# EasyEDA Pro project OpenEarable-PCB-main-2.0.epro, board OpenEarable v2.7 Main - Layout
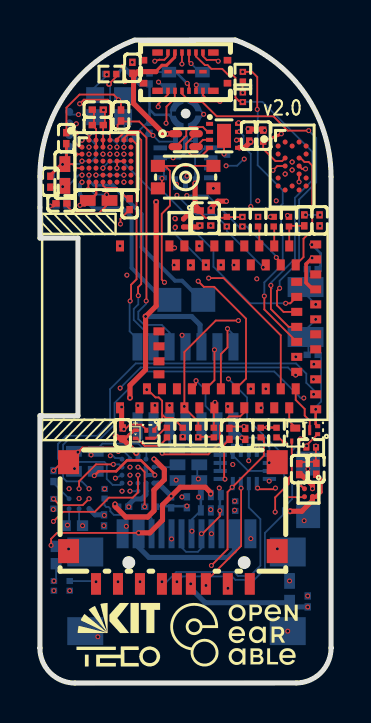
[diagram p1: board, top side]
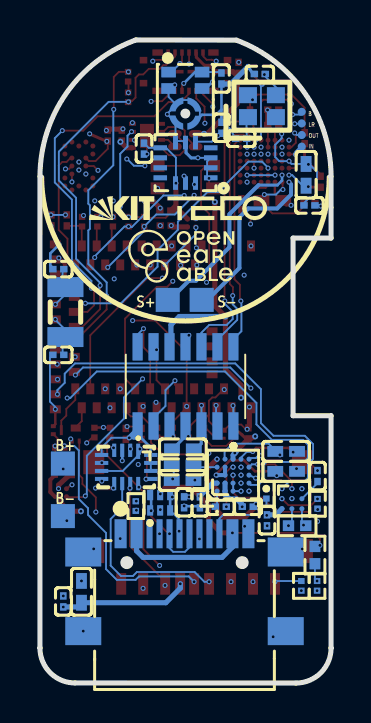
[diagram p2: board, bottom side, seen from below]

Outline 14.58 x 32.18 mm; copper layers: Top Layer, GROUND PLANE, Inner1, Inner2, POWER PLANE, Bottom Layer. Coordinates in mm from the lower left corner of the outline.
Outline path: 0,25.34 0,22.27 1.9,22.27 1.9,13.38 0,13.38 0,1.75 arc(0.51,0.51) 1.75,0 12.83,0 arc(14.07,0.52) 14.58,1.75 14.58,1.76 14.58,25.34 arc(13.25,29.52) 9.78,32.18 4.74,32.17 arc(1.3,29.5) 0,25.34
Stack: Top Layer 0.035mm 外层铜厚1oz / Dielectric1 0.0994mm 3313 RC57% 4.2mil / GROUND PLANE 0.0152mm 内层铜厚 / Dielectric2 0.55mm 0.55mm H/H不含铜 / Inner1 0.0152mm 内层铜厚 / Dielectric3 0.1088mm 2116 RC54% 4.9mil / Inner2 0.0152mm 内层铜厚 / Dielectric4 0.55mm 0.55mm H/H不含铜 / POWER PLANE 0.0152mm 内层铜厚 / Dielectric5 0.0994mm 3313 RC57% 4.2mil / Bottom Layer 0.035mm 外层铜厚1oz

## Design rules (mm)
template: Custom Config
spacing copperThickness1oz (default): track to track 0.09, other pairs 0.1 to 0.4
spacing copperThickness2oz: track to track 0.203, other pairs 0.152 to 0.3
spacing copperThicknessInner0.5oz: track to track 0.089, other pairs 0.152 to 0.3
track width copperThickness1oz (default): min 0.09, default 0.254, max 2.54
track width copperThickness2oz: min 0.203, default 0.254, max 2.54
track width copperThickness0.5oz: min 0.089, default 0.254, max 2.54
differential pair differentialPair (default): width min 0.127, default 0.254, max 2.54; gap min 0.152, default 0.152
via viaSize (default): diameter min 0.25, default 0.25, max 0.5; hole min 0.15, default 0.15, max 0.5

## Placement (name value [footprint] x y rotation side)
C1  1uF  [C0201]  8.28 22.89 180 top
C2  9pF  [C0201]  13.66 20.71 180 bottom
C3  4.7uF  [C0201]  13.24 23.15 90 top
C4  4.7uF  [C0201]  14 23.15 270 top
C5  1uF  [C0201]  10.48 27.39 270 top
C6  100nF  [C0201]  13.41 4.08 90 bottom
C7  1uF  [C0201]  8.3 23.64 0 top
C8  10uF  [C0402]  12.5 4.56 270 bottom
C9  1uF  [C0201]  7.36 9.05 270 bottom
C10  1uF  [C0201]  5.52 8.82 0 bottom
C11  100nF  [C0201]  9.37 26.74 90 bottom
C12  100nF  [C0201]  10.28 12.47 270 top
C13  100nF  [C0201]  5.49 27.79 90 bottom
C14  9pF  [C0201]  13.66 16.42 180 bottom
C16  4.7uF, 10V  [C0402]  2.25 10.59 0 bottom
C17  1uF &gt;10V  [C0201]  4.14 12.49 90 top
C18  10uF, &gt;4V  [C0402]  7.44 10.14 180 bottom
C19  1uF &gt;10V  [C0201]  4.17 8.82 180 bottom
C20  4.7uF, 10V  [C0402]  2.25 11.59 0 bottom
C21  1uF  [C0201]  3.21 8.14 90 bottom
C22  1uF &gt;10V  [C0201]  6.57 9.04 270 bottom
C23  2.2uF  [C0201]  0.68 10.36 270 bottom
C26  100nF  [C0201]  9.49 12.47 90 top
C27  100nF  [C0201]  11.18 27.39 270 top
C28  1uF  [C0201]  12.98 10.7 90 top
C29  1uF  [C0201]  13.84 10.72 270 top
C31  100nF  [C0201]  2.9 28.69 0 top
C32  1uF  [C0201]  4.49 23.96 270 top
C33  10uF  [C0402]  2.94 24.15 0 top
C34  10uF  [C0402]  1.25 25.43 270 bottom
C36  1uF  [C0201]  2.9 27.92 0 top
C38  100nF  [C0201]  5.49 30.25 90 bottom
C40  100nF  [C0201]  4.06 28.4 90 top
C41  10uF  [C0402]  1.25 25.42 270 top
C42  100nF  [C0201]  1.08 24 0 top
C43  100nF  [C0201]  1.32 27.27 90 top
C44  100nF  [C0201]  1.08 23.9 180 bottom
C45  33pF  [C0201]  3.56 30.48 0 bottom
C46  33pF  [C0201]  4.5 27.24 180 bottom
C47  1uF  [C0201]  0.52 25.09 270 top
C48  100nF  [C0201]  4.63 30.79 90 top
C49  10nF  [C0402]  7.42 11.72 180 bottom
CARD1  TF-06A  [TF-SMD_TF-06A]  6.66 8.01 180 top
CN1  BM46B-12DS-0.35V(53)  [FPC-SMD_12P-P0.35_BM46B-12DS-0.35V]  7.29 30.59 0 top
CRYSTAL1  24.576MHz  [CRYSTAL-SMD_4P-L2.0-W1.6-BL_HUAXIN_CN4]  3.46 28.87 180 bottom
D2  PRTR5V0U2F  [SON-6_L1.5-W1.0-P0.50-BL]  8.56 9.02 180 bottom
J1  CLE-107-01-G-DV  [CLE-107-01-X-DV]  7.29 14.84 180 bottom
L2  2.2uH  [L0402]  7.44 10.92 0 bottom
LED3  MHPA1010RGBDT  [LED-ARRAY-SMD_4P-L1.0-W1.0-TR-RD]  7.3 27.16 90 top
MDBT531  -  [MDBT53]  7.26 17.82 90 top
NOREF  -  [Pad_e353]  13.43 8.35 0 top
NOREF#2  -  [Pad_e359]  1.47 27.42 0 top
NOREF#3  -  [Pad_e357]  1.47 28.01 0 top
NOREF#4  -  [Pad_e355]  6.48 19.17 0 top
NOREF#5  -  [Pad_e358]  1.47 26.84 0 top
NOREF#6  -  [Pad_e354]  8.18 19.17 0 top
NOREF#7  -  [Pad_e352]  13.43 10.98 0 top
NOREF#8  -  [Pad_e356]  1.47 28.59 0 top
Q1  CSD23382F4  [PICOSTAR-3_L1.0-W0.6-P0.35-TL]  12.79 12.43 90 top
Q2  CSD13380F3T  [PICOSTAR-3_L0.7-W0.6-P0.40-TL]  5.53 12.45 270 top
Q3  CSD13380F3T  [PICOSTAR-3_L0.7-W0.6-P0.40-TL]  13.71 12.65 180 top
R1  10kΩ  [R0201]  13.59 11.79 0 top
R2  10kΩ  [R0201]  8.71 12.53 90 top
R3  10kΩ  [R0201]  7.93 12.53 90 top
R4  510Ω  [R0201]  6.36 12.53 90 top
R5  2kΩ  [R0201]  9.36 23.09 270 top
R6  51kΩ  [R0201]  0.7 4.86 90 bottom
R7  5.1kΩ  [R0201]  9.78 8.86 270 bottom
R8  5.1kΩ  [R0201]  3.24 9.47 270 bottom
R9  2kΩ  [R0201]  10.14 23.09 270 top
R10  2kΩ  [R0201]  10.16 29.31 270 top
R11  2kΩ  [R0201]  10.16 30.34 90 top
R13  37.4kΩ, 1%  [R0402]  0.81 6.4 90 bottom
R15  10kΩ  [R0201]  11.85 12.53 90 top
R17  10kΩ  [R0201]  0.68 8.97 270 bottom
R19  10kΩ  [R0201]  1.49 4.86 270 bottom
R20  10kΩ  [R0201]  11.06 12.53 90 top
R21  10mΩ, 1%  [R0402]  1.7 7.87 0 bottom
R23  27Ω  [R0201]  11.71 23.09 270 top
R26  27Ω  [R0201]  10.92 23.09 270 top
R27  2.2Ω  [R0201]  12.47 23.09 270 top
R28  220Ω  [R0201]  3.58 30.48 0 top
SW1  TS2819A 230GF  [SW-SMD_4P-L2.8-W1.9-P1.16-LS3.0]  7.3 25.32 0 top
U1  BMX160  [LGA-14_L3.0-W2.5-P0.50-BL]  7.29 26.03 90 bottom
U2  BQ25120AYFPR  [DSBGA-25_L2.5-W2.6-R5-C5-P0.40-BL]  4.91 10.4 180 bottom
U3  AP22916BCA4-7  [x1-wlb0808-4_l0.8-w0.8-p0.40-tl]  6.99 23.02 270 top
U4  XL-0201SURC  [LED-SMD_L0.65-W0.35-P0.41_XL-0201SURC]  4.79 12.44 90 top
U5  KTD2026  [DFN-8_L1.5-W1.5-P0.40-BL-EP]  9.22 27.38 270 top
U6  BQ27220YZFR  [DSBGA-9_L1.7-W1.6-R3-C3-P0.50-BL]  1.96 9.22 270 bottom
U8  1MΩ  [R0201]  7.15 12.53 270 top
U9  AP22916BCA4-7  [x1-wlb0808-4_l0.8-w0.8-p0.40-tl]  13.45 9.52 270 top
U10  SN74AXC4T774RSVR  [UQFN-16_L2.6-W1.8-P0.40-BL]  10.26 10.81 0 bottom
U12  GT-USB-9047A  [USB-C-SMD_GT-USB-9047A]  7.34 5.03 180 bottom
U13  SPH0641LU4H-1  [MIC-SMD_5P_L3.5-W2.7-P0.82_SPH0641LU4H-1]  7.3 29.31 180 bottom
U14  MX25R6435FBFIL0  [WLCSP-22_MX25R6435FBFIL0]  12.63 25.87 0 top
U15  ADAU1860BCBZRL  [BGA-56_L3.0-W2.7-P0.35-R8-C7-TL]  3.33 26.12 0 top
X1  Q13FC1350000200  [FC-135R_L3.2-W1.5]  13.3 18.56 90 bottom

## Footprints (pads in the part's own frame, mm; a bottom-side part is the same pattern mirrored in y, then rotated)
BGA-56_L3.0-W2.7-P0.35-R8-C7-TL
  round 0.25 smd: A1(-1.225,1.05) A2(-0.875,1.05) A3(-0.525,1.05) A4(-0.175,1.05) A5(0.175,1.05) A6(0.525,1.05) A7(0.875,1.05) A8(1.225,1.05) B1(-1.225,0.7) B2(-0.875,0.7) B3(-0.525,0.7) B4(-0.175,0.7) B5(0.175,0.7) B6(0.525,0.7) B7(0.875,0.7) B8(1.225,0.7) C1(-1.225,0.35) C2(-0.875,0.35) C3(-0.525,0.35) C4(-0.175,0.35) C5(0.175,0.35) C6(0.525,0.35) C7(0.875,0.35) C8(1.225,0.35) D1(-1.225,0) D2(-0.875,0) D3(-0.525,0) D4(-0.175,0) D5(0.175,0) D6(0.525,0) D7(0.875,0) D8(1.225,0) E1(-1.225,-0.35) E2(-0.875,-0.35) E3(-0.525,-0.35) E4(-0.175,-0.35) E5(0.175,-0.35) E6(0.525,-0.35) E7(0.875,-0.35) E8(1.225,-0.35) F1(-1.225,-0.7) F2(-0.875,-0.7) F3(-0.525,-0.7) F4(-0.175,-0.7) F5(0.175,-0.7) F6(0.525,-0.7) F7(0.875,-0.7) F8(1.225,-0.7) G1(-1.225,-1.05) G2(-0.875,-1.05) G3(-0.525,-1.05) G4(-0.175,-1.05) G5(0.175,-1.05) G6(0.525,-1.05) G7(0.875,-1.05) G8(1.225,-1.05)
C0201
  rect 0.368x0.324 smd: 1(-0.275,0) 2(0.274,0)
C0402
  rect 0.79x0.54 smd: 1(-0.545,0) 2(0.545,0)
CLE-107-01-X-DV
  custom 0.508x1.37 smd: 1(2.4,-1.98) 2(2.4,1.98) 3(1.6,-1.98) 4(1.6,1.98) 5(0.8,-1.98) 6(0.8,1.98) 7(0,-1.98) 8(0,1.98) 9(-0.8,-1.98) 10(-0.8,1.98) 11(-1.6,-1.98) 12(-1.6,1.98) 13(-2.4,-1.98) 14(-2.4,1.98)
CRYSTAL-SMD_4P-L2.0-W1.6-BL_HUAXIN_CN4
  rect 0.9x0.8 smd: 1(-0.7,-0.55) 2(0.7,-0.55) 3(0.7,0.55) 4(-0.7,0.55)
DFN-8_L1.5-W1.5-P0.40-BL-EP
  rect 0.2x0.35 smd: 1(-0.6,-0.725) 2(-0.2,-0.725) 3(0.2,-0.725) 4(0.6,-0.725) 5(0.6,0.725) 6(0.2,0.725) 7(-0.2,0.725) 8(-0.6,0.725)
  rect 1.2x0.7 smd: 9(0,0)
DSBGA-9_L1.7-W1.6-R3-C3-P0.50-BL
  round 0.25 smd: A1(-0.5,-0.5) A2(-0.5,0) A3(-0.5,0.5) B1(0,-0.5) B2(0,0) B3(0,0.5) C1(0.5,-0.5) C2(0.5,0) C3(0.5,0.5)
DSBGA-25_L2.5-W2.6-R5-C5-P0.40-BL
  round 0.25 smd: A1(-0.8,-0.8) A2(-0.8,-0.4) A3(-0.8,0) A4(-0.8,0.4) A5(-0.8,0.8) B1(-0.4,-0.8) B2(-0.4,-0.4) B3(-0.4,0) B4(-0.4,0.4) B5(-0.4,0.8) C1(0.002,-0.8) C2(0,-0.4) C3(0,0) C4(0,0.4) C5(0,0.8) D1(0.4,-0.8) D2(0.4,-0.4) D3(0.4,0) D4(0.4,0.4) D5(0.4,0.8) E1(0.8,-0.8) E2(0.8,-0.4) E3(0.8,0) E4(0.8,0.4) E5(0.8,0.8)
FC-135R_L3.2-W1.5
  rect 1x1.8 smd: 1(-1.25,0) 2(1.25,0)
FPC-SMD_12P-P0.35_BM46B-12DS-0.35V
  rect 0.18x0.315 smd: 1(-0.875,0.958) 2(-0.875,-0.958) 3(-0.525,0.958) 4(-0.525,-0.958) 5(-0.175,0.958) 6(-0.175,-0.958) 7(0.175,0.958) 8(0.175,-0.958) 9(0.525,0.958) 10(0.525,-0.958) 11(0.875,0.958) 12(0.875,-0.958)
  rect 0.525x0.315 smd: 13(1.397,0.958) 14(1.398,-0.958) 15(-1.397,0.958) 16(-1.398,-0.958)
  rect 0.38x0.33 smd: 17(2.105,0.575) 18(2.105,-0.575) 19(-2.105,0.575) 20(-2.105,-0.575)
  rect 0.37x0.18 smd: 21(-0.875,0) 22(-0.285,0) 23(0.285,0) 24(0.875,0)
L0402
  rect 0.79x0.54 smd: 1(-0.545,0) 2(0.545,0)
LED-ARRAY-SMD_4P-L1.0-W1.0-TR-RD
  oval 0.364x0.687 smd: 1(0.325,0.518) 2(0.325,-0.519) 3(-0.325,-0.519) 4(-0.325,0.518)
LED-SMD_L0.65-W0.35-P0.41_XL-0201SURC
  rect 0.17x0.28 smd: 1(0.205,0) 2(-0.205,0)
LGA-14_L3.0-W2.5-P0.50-BL
  rect 0.25x0.675 smd: 1(-0.75,-1.262) 2(-0.25,-1.262) 3(0.25,-1.262) 4(0.75,-1.262) 8(0.75,1.262) 9(0.25,1.262) 10(-0.25,1.262) 11(-0.75,1.262)
  rect 0.675x0.25 smd: 5(1.013,-0.5) 6(1.013,0) 7(1.013,0.5) 12(-1.013,0.5) 13(-1.013,0) 14(-1.013,-0.5)
MDBT53
  rect 0.55x0.4 smd: 1(-4.05,3.25) 2(-4.05,2.275) 3(-3.1,1.9) 4(-4.05,1.525) 5(-3.1,1.15) 6(-4.05,0.775) 7(-3.1,0.4) 8(-4.05,0.025) 9(-3.1,-0.35) 10(-4.05,-0.725) 11(-3.1,-1.05) 12(-4.05,-1.475) 13(-3.1,-1.8) 14(-4.05,-2.225) 15(-3.1,-2.55) 16(-4.05,-2.975) 17(-3.1,-3.3) 18(-4.05,-3.725) 19(-3.1,-4.05) 20(-4.05,-4.475) 21(-3.1,-4.8) 22(-4.05,-5.225) 23(-3.1,-5.55) 43(3.1,-5.55) 44(4.05,-5.225) 45(3.1,-4.8) 46(4.05,-4.475) 47(3.1,-4.05) 48(4.05,-3.725) 49(3.1,-3.3) 50(4.05,-2.975) 51(3.1,-2.55) 52(4.05,-2.225) 53(3.1,-1.8) 54(4.05,-1.475) 55(3.1,-1.05) 56(4.05,-0.725) 57(3.1,-0.3) 58(4.05,0.025) 59(3.1,0.45) 60(4.05,0.775) 61(4.05,3.25)
  rect 0.4x0.55 smd: 24(-4.125,-6.55) 25(-3.375,-6.55) 26(-2.625,-6.55) 27(-2.25,-5.6) 28(-1.875,-6.55) 29(-1.5,-5.6) 30(-1.125,-6.55) 31(-0.75,-5.6) 32(-0.375,-6.55) 33(0,-5.6) 34(0.375,-6.55) 35(0.75,-5.6) 36(1.125,-6.55) 37(1.5,-5.6) 38(1.875,-6.55) 39(2.25,-5.6) 40(2.625,-6.55) 41(3.375,-6.55) 42(4.125,-6.55) 62(-2.375,1.3) 63(-1.725,1.3) 64(-0.975,1.3) 65(-0.225,1.3)
MIC-SMD_5P_L3.5-W2.7-P0.82_SPH0641LU4H-1
  rect 0.73x0.53 smd: 1(-0.838,1.26) 2(-0.838,0.438) 4(0.838,0.438) 5(0.838,1.26)
  custom 0.696x0.705 smd: 3(0.459,-0.379) 7(-0.459,-1.25)
  custom 0.704x0.696 smd: 6(0.453,-1.26) 8(-0.453,-0.369)
Pad_e352
  rect 1.2x1.2 smd far side: 14(0,0)
Pad_e353
  rect 1.2x1.2 smd far side: 14(0,0)
Pad_e354
  rect 1.2x1.2 smd far side: 11(0,0)
Pad_e355
  rect 1.2x1.2 smd far side: 11(0,0)
Pad_e356
  round 0.4 smd far side: 11(0,0)
Pad_e357
  round 0.4 smd far side: 11(0,0)
Pad_e358
  round 0.4 smd far side: 11(0,0)
Pad_e359
  round 0.4 smd far side: 11(0,0)
PICOSTAR-3_L0.7-W0.6-P0.40-TL
  rect 0.25x0.2 smd: 1(-0.2,0.2) 2(-0.2,-0.2)
  rect 0.15x0.5 smd: 3(0.2,0)
PICOSTAR-3_L1.0-W0.6-P0.35-TL
  rect 0.25x0.15 smd: 1(-0.325,0.175) 2(-0.325,-0.175)
  rect 0.35x0.5 smd: 3(0.325,0)
R0201
  rect 0.303x0.324 smd: 1(-0.241,0) 2(0.241,0)
R0402
  rect 0.566x0.54 smd: 1(-0.433,0) 2(0.432,0)
SON-6_L1.5-W1.0-P0.50-BL
  rect 0.3x0.52 smd: 1(-0.5,-0.385) 2(0,-0.385) 3(0.5,-0.385) 4(0.5,0.385) 5(0,0.385) 6(-0.5,0.385)
SW-SMD_4P-L2.8-W1.9-P1.16-LS3.0
  rect 0.7x0.6 smd: 1(-1.39,0.563) 2(1.39,0.563) 3(-1.39,-0.563) 4(1.39,-0.563)
TF-SMD_TF-06A
  rect 0.5x1.08 smd: 1(-3.85,3.045) 2(-2.75,3.045) 3(-1.65,3.045) 4(-0.9,3.045) 5(0.55,3.045) 6(1.65,3.045) 7(2.75,3.045) 8(3.85,3.045) G(-0.2,3.045)
  rect 1.05x1.2 smd: 10(5.225,1.405) 11(5.225,-3.045) 12(-5.225,-3.045) 13(-5.225,1.405)
UQFN-16_L2.6-W1.8-P0.40-BL
  rect 0.2x0.765 smd: 1(-0.6,-0.782)
  rect 0.2x0.665 smd: 2(-0.2,-0.833) 3(0.2,-0.833) 4(0.6,-0.833) 9(0.6,0.833) 10(0.2,0.833) 11(-0.2,0.833) 12(-0.6,0.833)
  rect 0.665x0.2 smd: 5(1.232,-0.6) 6(1.232,-0.2) 7(1.232,0.2) 8(1.232,0.6) 13(-1.232,0.6) 14(-1.232,0.2) 15(-1.232,-0.2) 16(-1.232,-0.6)
USB-C-SMD_GT-USB-9047A
  rect 1.8x1.45 smd: 12(-5.07,1.524) 13(5.07,1.524)
  rect 1.8x1.4 smd: 14(-5.07,-2.437) 15(5.07,-2.437)
  rect 0.6x1.45 smd: A1B12(-3.2,2.437) A4B9(-2.4,2.437) A9B4(2.4,2.437) A12B1(3.2,2.437)
  rect 0.3x1.45 smd: A5(-1.25,2.437) A6(-0.25,2.437) A7(0.25,2.437) A8(1.25,2.437) B5(1.75,2.437) B6(0.75,2.437) B7(-0.75,2.437) B8(-1.75,2.437)
WLCSP-22_MX25R6435FBFIL0
  round 0.25 smd: A2(-0.35,1.2) A4(0.35,1.2) B1(-0.7,1) B3(0,1) B5(0.7,1) C1(-0.7,0.6) C5(0.7,0.6) D2(-0.35,0.4) D4(0.35,0.4) E3(0,0.2) F2(-0.35,0) F4(0.35,0) G3(0,-0.2) H2(-0.35,-0.4) H4(0.35,-0.4) J1(-0.7,-0.6) J5(0.7,-0.6) K1(-0.7,-1) K3(0,-1) K5(0.7,-1) L2(-0.35,-1.2) L4(0.35,-1.2)
x1-wlb0808-4_l0.8-w0.8-p0.40-tl
  round 0.25 smd: A1(-0.2,0.2) A2(0.2,0.2) B1(-0.2,-0.201) B2(0.2,-0.201)

## Nets
As in the schematic, except:
GND: C1.1 C2.1 C3.2 C4.1 C5.1 C6.2 C7.2 C8.1 C9.2 C10.2 C11.1 C12.1 C13.2 C14.1 C16.1 C17.2 C18.2 C19.2 C20.1 C21.1 C22.2 C23.1 C26.2 C27.1 C28.2 C29.1 C31.2 C32.2 C33.1 C34.2 C36.2 C38.1 C40.2 C41.2 C42.1 C43.2 C44.2 C45.2 C46.1 C47.2 C48.2 C49.1 CARD1.6 CARD1.10 CARD1.11 CARD1.12 CARD1.13 CN1.10 CRYSTAL1.2 CRYSTAL1.4 D2.2 J1.7 MDBT531.1 MDBT531.24 MDBT531.42 MDBT531.61 NOREF.14 Q2.2 Q3.2 R1.2 R6.1 R7.1 R8.1 R17.2 R19.2 SW1.3 SW1.4 U1.1 U1.2 U1.3 U1.6 U1.7 U2.A1 U2.A5 U2.C1 U2.C2 U2.D1 U2.D5 U3.B1 U5.8 U5.9 U6.B2 U8.2 U9.B1 U10.6 U10.8 U12.12 U12.13 U12.14 U12.15 U12.A1B12 U12.A12B1 U13.2 U13.3 U13.6 U13.7 U13.8 U14.E3 U15.A1 U15.A4 U15.B4 U15.D6 U15.D7 U15.E6 U15.F1 U15.G3 U15.G7
BCLK: MDBT531.59 NOREF#8.11 U15.B2
DAC_N: NOREF#4.11 U15.G1
DAC_P: NOREF#6.11 U15.F2
DIN: MDBT531.60 NOREF#5.11 U15.C1
DOUT: MDBT531.56 NOREF#2.11 U15.B1
LRCLK: MDBT531.57 NOREF#3.11 U15.C2
V_BAT: C21.2 NOREF#7.14 R21.1 U6.C1 U6.C3

Pads without a net: CARD1 1; CN1 13 14 15 16 17 18 19 20 21 22 23 24; MDBT531 5 7 10 20 28 30 32 39 40 49 50 52 54 58 62 63 64 65; U1 4 9 10 11; U5 1; U12 A8 B8; U14 A2 A4 B1 B3 B5 C1 C5 J1 J5 K1 K3 K5 L2 L4; U15 B8 C3 C8 D2 D3 D4 D5 D8 E2 E3 E5 E7 E8 F4 F5 F6 F8 G5 G6 G8

## Via types
v1: diameter 0.25, hole 0.15, Top Layer to Bottom Layer, 250 vias
v2: diameter 0.3, hole 0.15, Top Layer to Bottom Layer, 10 vias

## Routing (per net, layer and track width the routed paths; a pad name or vN(x,y) marks a point on that pad's centre or on a via; arc(x,y) is an arc through that point)
3V3: length 50.4
  Top Layer w0.15: 5.78,30.58 6.11,30.91 6.34,30.91 6.75,31.32 6.75,31.53 ; 4.9,12.65 4.73,12.65 4.46,12.42 4.23,12.19
  Top Layer w0.2: 13.65,9.32 13.83,9.32 14.06,9.56 14.06,10.18 13.84,10.4 C29.2
  Top Layer w0.25: 4.83,11.51 4.18,12.19
  Top Layer w0.254: 5.82,30.59 4.91,30.59 4.69,30.37 4.69,29 6.2,27.49 6.43,27.49 ; 9.98,26.78 9.98,26.79 10.22,26.79 ; 6.36,27.49 6.78,27.49 LED3.1 ; v2(10.55,27.09) 10.54,27.09 10.24,26.78 ; 5.82,24.07 5.82,18.87 5.3,18.34 ; v2(5.29,18.34) 5.29,15.68 4.51,14.9 4.51,14.28 ; 3.8,12.34 4.18,12.15 ; 4.18,12.15 4.22,12.19 4.23,12.19 4.18,12.15 ; v2(12.53,8.6) 13.11,8.6 13.65,9.13 13.65,9.32
  Inner1 w0.254: 4.51,14.28 4.51,13.6 3.8,12.89 3.8,12.34 ; v2(10.55,27.09) 10.83,27.37 10.83,28.01 10.38,28.47 9.57,28.47 8.59,27.49 6.36,27.49
  Inner2 w0.254: 4.82,11.51 5.31,11.02 5.31,9.39 6.49,8.21 10.77,8.21 11.52,8.96 12.31,8.96 12.53,8.74 12.53,8.59 ; v2(6.36,27.48) 6.36,27.21 5.6,26.46 5.6,24.29 v2(5.82,24.07)
  Bottom Layer w0.24: 4.74,11.58 4.91,11.4 4.91,11.2
  Bottom Layer w0.254: 5.29,18.34 7.6,18.34 8.02,17.92 8.02,16.93 8.09,16.86
  vias: v2(3.8,12.34) v2(4.51,14.28) v2(4.82,11.51)
+1.8V: length 11.3
  Top Layer w0.09: v1(7.92,12.32) 8.68,12.32 R2.1
  Top Layer w0.18: v1(13.63,21.27) 13.33,20.97 13.33,20.03 13.67,19.7 MDBT531.38
  Top Layer w0.254: v1(8.01,22.89) 7.94,22.82 U3.A2
  Inner1 w0.09: v1(9.66,10.94) 8.66,10.94 v1(7.93,10.21)
  Inner1 w0.254: 14.03,22.88 14.02,22.87 14.02,21.66 v1(13.63,21.27)
  Bottom Layer w0.09: 2.81,11.66 3.13,11.98 4.93,11.98 5.33,11.58 5.33,11.28 ; 7.89,10.3 7.88,10.31 7.88,10.97 7.86,11
  vias: v1(2.56,11.42) v1(13.04,12.22) v1(14.03,22.88)
GND: length 58.8
  Top Layer w0.09: 1.33,27.47 1.33,28.79 1.98,29.45 3.69,29.45 3.91,29.23 ; 6.11,25.25 6.11,24.92 5.99,24.8 ; 7.84,29.93 7.84,29.68 7.82,29.66 ; v1(3.93,29.19) 4.06,29.06 C40.2 ; C32.2 4.03,23.23 v1(4.03,22.97) ; v1(9.22,26.47) U5.9 ; 13.08,10.98 13.16,11.06 13.76,11.07 C29.1 13.82,11.02 v1(13.82,11.86) ; 3.17,26.81 3.17,27.83 3.25,27.92 3.25,28.57 3.27,28.58 ; 4.18,12.7 4.26,12.7 4.5,12.93 5.07,12.93 5.31,12.69 ; 3.87,25.76 3.87,26.11 4.22,26.11 ; v1(10.22,12.84) 9.58,12.84 C26.2 ; 1.43,11.11 1.15,11.11 v1(0.68,10.63)
  Top Layer w0.1: 12.94,9.87 13.08,9.87 13.23,9.73
  Top Layer w0.12: v1(2,23.91) 2.25,23.91 2.81,24.47 2.81,25.06
  Top Layer w0.127: 1.92,11.55 2.13,11.77 3.75,11.77 3.93,11.57 ; v1(13.81,13.7) 13.81,12.95 Q3.2
  Top Layer w0.15: 0.52,23.88 0.68,23.88 0.79,23.99 ; 0.53,24.81 1.13,24.81 1.15,24.83
  Top Layer w0.254: v1(4.09,13.81) 4.09,12.85 4.18,12.77 ; 8.55,23.76 8.9,24.11 9.33,24.11 ; 10.44,27.72 11.15,27.72 11.2,27.67
  Top Layer w0.257: 5.72,11.2 6.23,10.69 6.23,10.18 5.71,9.66 5.71,8.62 5.4,8.31 4.3,8.31 3.76,8.85 3.76,8.96
  Inner2 w0.09: 10.91,24.13 10.81,24.23 9.44,24.21 v1(9.34,24.11)
  Inner2 w0.127: 1.14,24.84 0.51,24.21 v1(0.51,23.87)
  Bottom Layer w0.09: 3.93,11.57 4.22,11.57 4.52,11.27 ; 4.52,9.6 4.9,9.6 4.9,10 4.9,10 ; 4.76,27.16 5.03,27.7 5.47,28.14 ; v1(6.67,26.28) U1.3 6.21,26.1 6.21,25.3 ; v1(13.3,23.43) v1(14.03,23.43) ; U13.2 8.14,29.33 U13.8 7.52,29.18 7.02,29.18 6.84,29 6.84,28.93 6.57,28.67 6.57,28.33 6.85,28.05 ; C10.2 5.71,8.91 U2.A1 ; v1(13.81,13.7) 13.81,13.81 14.08,14.08 14.08,16.28 C14.1 ; 7.75,28.94 8.2,28.49 v1(8.2,28.46) 7.79,28.05 7.79,27.05 7.71,27.12 7.29,27.12 ; v1(1.14,24.84) 1.37,24.84 1.94,25.41 2.12,25.41
  Bottom Layer w0.127: 5.49,28.69 5.49,28.11 5.49,28.11 ; v1(13.62,21.94) 14.06,21.5 14.06,20.9 13.93,20.77 C2.1 ; 5.49,29.98 5.49,28.7 5.75,28.44 6.46,28.44 6.85,28.05 ; 7.36,8.85 5.82,8.85 C10.2
  Bottom Layer w0.15: 0.53,23.88 0.86,23.88 0.86,23.88 ; 3.88,30.45 3.9,30.45 4.15,30.85 ; 6.68,26.28 7.01,26.28 7.26,26.54 7.26,26.97 7.29,26.99 ; 7.22,12.42 7.74,11.9
  Bottom Layer w0.254: C38.1 5.03,29.98 v1(4.15,30.86)
  vias: v1(0.67,8.68) v1(0.7,4.62) v1(1.44,6.71) v1(1.49,4.62) v1(1.73,10.73) v1(1.9,11.55) v1(1.96,9.23) v1(2.11,27.17) v1(2.1,25.42) v1(2.9,2.31) v1(3.18,28.68) v1(3.2,7.87) v1(3.24,9.72) v1(3.76,8.96) v1(3.86,25.77) v1(3.92,11.59) v1(4.01,21.87) v1(4.21,25.07) v1(4.2,12.7) v1(4.33,7.84) v1(4.51,9.6) v1(4.62,31.06) v1(5.01,5.07) v1(5.71,11.2) v1(6.11,25.25) v1(6.76,23.25) v1(6.82,10.16) v1(7.15,12.34) v1(7.36,8.86) v1(7.83,29.93) v1(8.56,23.77) v1(8.55,22.89) v1(8.55,8.68) v1(8.69,24.75) v1(9.75,9.1) v1(9.95,28.04) v1(10.42,27.73) v1(10.56,7.23) v1(10.91,24.13) v1(11.25,27.65) v1(11.48,11.03) v1(11.48,10.11) v1(11.89,6.71) v1(12.41,2.6) v1(12.5,5.11) v1(12.63,26.07) v1(12.97,9.92) v1(13.23,8.12) v1(13.41,4.36)
VCC: length 5.9
  Inner1 w0.254: 2.13,7.87 2.55,7.46 3.35,7.46 4.45,8.55 v1(4.45,8.82)
  Bottom Layer w0.09: U6.C2 1.96,8.05 v1(2.13,7.87)
  Bottom Layer w0.25: 4.45,8.82 4.45,8.94 4.73,9.21 5.09,9.21 5.31,9.43 5.31,9.61 ; U2.B2 U2.B1
(no net):
  vias: v1(13.72,15.95)
#ERROR: length 4
  Top Layer w0.09: 6.12,13.52 6.12,13.1 5.71,12.69 ; 5.36,14.72 5.79,14.29 5.95,14.29 6.12,14.13 6.12,13.44 6.28,13.27 6.65,13.27 7.15,12.78 ; v1(5.35,14.68) 5.36,14.69 MDBT531.3
BCLK: length 10.7
  Inner2 w0.09: 6.65,20.86 6.65,20.94 4.76,22.83 4.76,23.59 3.49,24.86 3.49,25.89 3.28,26.1 2.91,26.1 2.79,26.22 2.79,26.61 2.58,26.81 2.46,26.81 2.56,26.81 2.81,27.06 2.81,27.64 2,28.45 v1(1.93,28.45)
  Bottom Layer w0.09: v1(1.93,28.45) 1.56,28.45 1.48,28.52
  vias: v1(2.46,26.82) v1(6.72,20.92)
CC_#CD: length 20.5
  Inner1 w0.09: v1(13.21,14.26) 13.35,14.39 13.35,14.84 v1(13.7,15.2)
  Bottom Layer w0.09: U2.E2 4.02,9.91 3.64,9.91 3.35,10.21 3.35,10.94 3.23,11.06 1.36,11.06 1.16,11.26 1.16,11.92 1.41,12.17 2.97,12.17 3.74,12.94 3.74,14.02 5.31,15.59 11.73,15.59 13.06,14.26 13.21,14.26
CC_#PG: length 7.8
  Top Layer w0.09: MDBT531.16 10.24,13.55 10.03,13.34 9.48,13.34 9.02,12.88 9.02,12.03 8.43,11.45 6.18,11.45 6.09,11.53
  Inner1 w0.09: 4.51,10.8 4.51,10.9 4.75,11.15 5.15,11.15 5.53,11.53 6.12,11.53 6.15,11.51
  vias: v1(4.51,10.8) v1(6.12,11.5)
DAC_ENABLE: length 13.6
  Top Layer w0.09: MDBT531.37 12.54,19 v1(12.31,19)
  Bottom Layer w0.09: v1(12.31,19) 10.52,19 8.69,20.83 8.69,21.66 7.67,22.68 7.67,23.09 6.19,24.57 5.66,24.57 4.14,26.09 3.46,26.09 3.16,25.8 3.16,25.76
  vias: v1(3.16,25.77)
DAC_N: length 8.7
  Bottom Layer w0.127: 2.1,25.06 2,24.96
  Bottom Layer w0.2: 2,24.96 2.01,24.44 2.7,23.75 4.15,23.75 4.59,23.31 4.59,20.77 6.33,19.03
  vias: v1(2.11,25.07)
DAC_P: length 9.1
  Bottom Layer w0.127: 2.69,24.92 2.46,25.15 v1(2.46,25.42)
  Bottom Layer w0.15: 2.69,24.92 3.63,24.92
  Bottom Layer w0.2: 3.63,24.92 5.09,23.46 5.09,21.81 6.77,20.13 7.12,20.13 7.88,19.37
DIN: length 8.7
  Top Layer w0.09: v1(1.78,26.46) 2.12,26.46
  Inner1 w0.09: v1(1.78,26.46) 1.78,24.85 2.52,24.12 4.33,24.12 6.67,21.78 6.74,21.78
  Bottom Layer w0.09: v1(1.78,26.46) 1.78,26.6 1.48,26.9
  vias: v1(6.74,21.78)
DOUT: length 12.5
  Top Layer w0.09: v1(1.82,27.53) 1.77,27.47 1.77,27.04 1.99,26.81 2.12,26.81
  Inner1 w0.09: 7.99,21.87 7.54,21.43 6.34,21.43 6.12,21.65 6.12,22.06 4.25,23.92 2.44,23.92 1.46,24.91 1.46,27.16 v1(1.82,27.53)
  Bottom Layer w0.09: 1.48,27.42 1.71,27.42 1.82,27.54
  vias: v1(7.98,21.87)
FLASH_RESET: length 6.5
  Top Layer w0.09: U14.F2 11.89,25.87 v1(11.67,25.66)
  Inner1 w0.09: v1(9.72,20.92) 9.72,23.58 10.75,24.6 11.19,24.6 11.54,24.95 11.54,25.52 v1(11.67,25.66)
GPOUT: length 19.8
  Bottom Layer w0.09: 2.46,9.72 2.09,10.09 1.33,10.09 1.16,10.26 1.16,10.96 0.9,11.23 0.9,11.96 1.31,12.37 2.88,12.37 3.51,13 3.51,14.71 4.8,15.99 12.83,15.99 13.34,15.48 13.34,15.02 13.71,14.66 v1(13.71,14.45)
  vias: v1(2.46,9.72)
INT: length 7.3
  Inner1 w0.09: v1(4.51,10) 6.16,10 6.64,10.48 7.47,10.48 9.41,12.43 v1(9.41,13.84)
IO1: length 3.3
  Top Layer w0.09: MDBT531.9 7.82,14.93 v1(7.82,15.13)
  Bottom Layer w0.09: 8.89,12.78 8.89,13.26 8.29,13.86 8.29,14.66 v1(7.82,15.13)
IO2: length 2.1
  Top Layer w0.09: MDBT531.11 8.74,15.15 v1(8.74,16.68)
IO3: length 4.3
  Top Layer w0.09: MDBT531.13 9.06,16.46 9.39,16.8 v1(9.39,17.73)
  Bottom Layer w0.09: 9.69,16.74 9.69,17.44 v1(9.39,17.73)
IO4: length 18.1
  Top Layer w0.09: MDBT531.35 12.2,18.57 11.87,18.9 11.87,19.62 12.01,19.76 ; CN1.6 7.11,29.49 7.53,29.08 8.13,29.08 8.85,28.36 11.69,28.36 12.41,27.64 v1(13.46,27.64)
  Bottom Layer w0.09: v1(13.46,27.64) 13.84,27.27 13.84,25.05 12.98,24.19 12.98,21.1 12,20.13 v1(12,19.76)
IO5: length 18.4
  Top Layer w0.09: 6.34,28.01 6.34,28.85 6.75,29.26 6.75,29.65 6.76,29.66 ; 12.06,14.72 12.06,17.4 9.2,20.26 8.45,20.26
  Inner2 w0.09: 8.45,20.26 7.88,20.83 7.88,21.51 7.22,22.17 7.22,23.26 6.49,23.99 6.49,25.57 7.01,26.09 7.01,27.32 v1(6.32,28.02)
  vias: v1(8.45,20.26)
IO6: length 18.1
  Top Layer w0.09: v1(5.92,28.84) 5.92,28.97 6.41,29.46 CN1.2 ; 9.81,14.72 10.32,15.23 10.32,18.23 8.73,19.83 8.21,19.83 7.93,20.11
  Inner2 w0.09: v1(7.93,20.11) 7.73,20.11 7.2,20.63 7.2,21.79 5.29,23.7 5.29,28.21 v1(5.92,28.84)
LRCLK: length 14
  Inner1 w0.09: 7.54,20.9 7.59,20.9 8.32,21.63 8.32,22.06 8,22.38 6.34,22.38 3.51,25.22 3.51,25.89 3.3,26.09 2.83,26.09 2.46,26.46
  Inner2 w0.09: 2.46,26.46 2.47,25.99 2.27,25.79 1.85,25.79 1.16,26.49 1.16,27.63 1.51,27.99 1.82,27.99
  Bottom Layer w0.09: 1.82,27.99 1.49,27.99 1.48,27.98
  vias: v1(1.82,27.99) v1(2.46,26.47) v1(7.54,20.9)
LSCTRL: length 14.9
  Inner1 w0.09: v1(3.78,10.25) 3.7,10.25 3.19,10.77 3.19,11.49 3.45,11.75 3.45,12.95 3.76,13.26 3.76,14.51 v1(4.02,14.76)
  Bottom Layer w0.09: 3.79,10.26 3.79,10.26 U2.E3 4.1,10.4 ; v1(4.02,14.76) 5.05,15.79 12.43,15.79 v1(12.8,15.41)
MR#: length 34.7
  Top Layer w0.09: 6.26,25.88 5.91,25.88 6.26,25.88 ; 6.26,25.88 6.51,25.63 6.51,23.89 6.1,23.48 6.1,20.19 6.24,20.05 ; 6.26,25.88 8.69,25.88 ; v1(11.78,8.56) 11.78,9.29 12.45,9.96 12.45,10.25 12.61,10.41 Q1.1
  Inner1 w0.09: 6.24,20.05 6.24,17.44 3.56,14.76 3.56,13.36 3.24,13.04 3.24,11.89 2.99,11.64 2.99,10.55 3.94,9.6 v1(4.11,9.6)
  Inner2 w0.09: 4.11,9.6 4.08,9.57 4.08,8.72 4.34,8.45 5.41,8.45 5.93,7.94 11.07,7.94 11.69,8.56 v1(11.78,8.56)
  vias: v1(6.24,20.05)
ON+BTN: length 1.2
  Top Layer w0.09: 12.83,12.76 12.48,13.1 MDBT531.22
PDMCLK: length 7.5
  Top Layer w0.09: 7.1,31.55 7.11,31.54 v1(7.11,30.98)
  Inner2 w0.09: 3.17,26.46 3.17,27.69 5.55,30.08 6.22,30.08 7.11,30.97
  Bottom Layer w0.127: 5.92,30.09 5.95,30.09 6.23,29.8
  vias: v1(3.16,26.47) v1(5.94,30.07)
PDMDIN: length 8.7
  Top Layer w0.09: CN1.7 7.46,31.1 v1(7.57,31)
  Inner2 w0.09: 7.57,31 7.57,30.87 5.98,29.29 5.86,29.29 5.08,28.5 5.08,26.85 4.36,26.14 3.7,26.14 3.52,26.32 3.52,26.46
  Bottom Layer w0.09: 8.14,30.57 8,30.57 v1(7.57,31)
  vias: v1(3.51,26.47)
RESETN: length 7
  Inner2 w0.09: 4.51,10.41 4.42,10.41 4.19,10.63 4.19,11.02 4.33,11.16 4.33,11.83 6.39,13.89 6.49,13.89
  Bottom Layer w0.09: v1(6.49,13.89) 6.49,12.9
  Bottom Layer w0.15: 6.5,12.87 6.5,11.98 6.78,11.7
  vias: v1(4.51,10.4)
RGB_B: length 2.4
  Top Layer w0.09: 8.49,27.58 8.4,27.58 8.16,27.82 7.51,27.82 7.33,27.64 7.33,27.39 LED3.4
RGB_G: length 0.8
  Top Layer w0.09: 7.82,26.84 8.16,27.18 U5.3
RGB_R: length 2.5
  Top Layer w0.09: U5.4 8.12,26.41 7.58,26.41 7.32,26.67 7.32,26.99 7.82,27.49
SCL: length 25.7
  Top Layer w0.09: R3.2 7.93,13.08 MDBT531.8 7.23,13.78 v1(7.23,13.84) ; 7.23,13.77 7.23,16.57 8.81,18.14 v1(9.94,18.14)
  Inner1 w0.09: 9.84,27.17 9.84,25.34 8.95,24.44 8.95,22.55 9.38,22.12 9.38,20.69 9.94,20.13 v1(9.94,18.14) ; 7.23,13.84 7.22,13.84 6.26,12.88 5.32,12.88 4.26,11.83 4.26,11.44 4.08,11.26 3.78,11.26 3.67,11.38 v1(3.52,11.38)
  Inner2 w0.09: 3.52,11.37 2.98,11.37 1.46,9.85 v1(1.46,9.72)
  Bottom Layer w0.09: v1(3.52,11.38) 3.65,11.38 3.77,11.26 4,11.26
  vias: v1(9.84,27.17)
SCL1: length 18.3
  Top Layer w0.09: 8.16,29.58 8.16,29.42 8.46,29.12 9.02,29.12 ; v1(11.84,21.3) 12.06,21.07 12.06,20.92
  Inner1 w0.09: 7.33,24.46 7.33,24.93 6.68,25.57 5.11,25.57 4.21,26.46 5.34,26.46 6,27.12 6,28.42 6.69,29.11 9.01,29.11
  Bottom Layer w0.09: 7.33,24.4 8.4,24.4 9.98,22.82 10.17,22.82 ; v1(10.14,22.85) 10.35,22.85 11.84,21.35 v1(11.84,21.3)
  vias: v1(4.21,26.47) v1(7.36,24.4) v1(9.01,29.11)
SCL2: length 27.3
  Top Layer w0.09: 7.82,31.51 7.82,31.35 8.26,30.92 8.4,30.92 8.58,30.74 9.13,30.74 9.41,30.46 9.62,30.46 9.79,30.29 9.79,29.3 9.96,29.13 10.17,29.13 ; 11.57,19.9 11.57,18.71 12.46,17.82 MDBT531.33
  Inner1 w0.09: 7.36,25.37 7.87,25.88 9.32,25.88 ; 10.24,26.22 10.93,26.22 11.59,26.88 11.59,28.55 11.06,29.09 10.14,29.09
  Bottom Layer w0.09: 9.32,25.88 9.88,25.89 10.22,26.23 ; v1(10.15,29.08) 11.14,29.08 13.63,26.59 13.63,25.15 12.77,24.28 12.77,21.23 11.55,20.01 11.55,19.82 11.62,19.75
  vias: v1(7.36,25.37) v1(9.32,25.88) v1(10.23,26.22) v1(11.56,19.9)
SD_ENABLE: length 14.1
  Top Layer w0.09: v1(12.31,9.36) 12.37,9.3 13.25,9.3
  Inner1 w0.09: v1(9.44,15.22) 9.44,15.23 9.71,15.5 9.71,17.9 9.61,18.01 9.61,20.08 9.06,20.63 9.06,20.92
  Bottom Layer w0.09: v1(9.44,15.22) 10.37,14.29 10.37,13.23 12.23,11.37 12.23,9.44 v1(12.31,9.36)
  vias: v1(9.06,20.92)
SD_STATE: length 2.4
  Top Layer w0.09: 12.81,14.72 12.81,14.17 13.26,13.72 13.26,13.38 13.51,13.13 Q3.3
SD_STATE_3V3: length 12.9
  Top Layer w0.09: 13.34,11.88 Q3.1
  Bottom Layer w0.09: 6.86,5.07 7.13,5.34 9.62,5.34 9.79,5.16 10.73,5.16 11.27,5.7 11.27,7.52 12.17,8.42 12.17,8.75 12.63,9.21 12.63,11.64 12.86,11.86 13.35,11.86
  vias: v1(6.86,5.07) v1(13.35,11.87)
SDA: length 26.3
  Top Layer w0.09: v1(1.96,9.72) 1.96,10.09 2.81,10.94 v1(3.68,10.94) ; MDBT531.12 8.77,13.8 v1(8.77,14.05) 8.71,13.99 R2.2
  Inner1 w0.09: v1(3.68,10.94) 4.07,10.94 4.45,11.33 4.45,11.68 5.45,12.68 7.38,12.68 8.87,14.16 9.98,14.16 10.12,14.31 10.12,16.62 10.26,16.76 10.26,19.51 10.16,19.61 10.16,21.19 10.56,21.59 v1(10.56,23.84)
  Bottom Layer w0.09: v1(10.56,23.84) 10.56,26.49 10.19,26.85 10.19,27.39 9.99,27.59 ; U2.E4 3.97,10.94 v1(3.68,10.94)
  vias: v1(9.99,27.59)
SDA1: length 22.2
  Top Layer w0.09: CN1.11 8.16,31.55 8.16,31.38 8.35,31.18 8.93,31.18
  Inner1 w0.09: 6.78,24.47 6.41,24.84 5.35,24.84 3.86,26.32 3.86,26.49
  Inner2 w0.09: 6.89,24.39 6.89,24.36 7.19,24.05 8.24,24.06 8.5,24.26 8.8,24.26 11.59,26.99 11.59,28.46 9.13,31.13 8.93,31.13
  Bottom Layer w0.09: v1(11.18,20.8) 9.36,22.63 v1(9.36,22.85) 8.76,23.45 7.82,23.45 6.83,24.44
  vias: v1(3.86,26.47) v1(6.86,24.41) v1(8.93,31.12)
SDA2: length 27.6
  Top Layer w0.09: 5.99,31.2 v1(5.75,31.12) ; 5.97,31.19 6.23,31.19 6.4,31.36 6.4,31.63 ; v1(10.15,30.59) 10.63,30.59 10.88,30.33 v1(10.88,28.71) ; v1(11.24,19.36) 11.24,18.7 MDBT531.31
  Inner1 w0.127: v1(5.75,31.12) 6.18,31.55 9.14,31.55 10.11,30.59
  Inner2 w0.09: 6.83,24.95 6.83,25.43 10.12,28.72 10.9,28.72
  Bottom Layer w0.09: 10.88,28.68 10.91,28.66 10.91,25.91 12.16,24.66 12.16,23.99 12.08,23.91 12.08,22.73 12.16,22.65 12.16,20.97 11.24,20.05 v1(11.24,19.36)
  vias: v1(6.84,24.95)
SENSORS_ENABLE: length 2.5
  Bottom Layer w0.09: v1(8.31,20.92) 6.77,22.47 v1(6.77,22.8)
SPI_CLK: length 16.4
  Inner1 w0.09: v1(12.81,16.32) 12.81,24.34 12.28,24.88 v1(12.28,25.47)
  Inner2 w0.09: v1(12.81,16.32) 11.93,15.44 11.93,14.56 11.64,14.28 11.05,14.28 10.74,13.97 10.74,12.08 10.46,11.8 v1(10.46,11.12)
  Bottom Layer w0.127: 10.46,11.64 10.46,11.16 10.48,11.14
SPI_CLK_SD: length 9.8
  Bottom Layer w0.09: 6.11,5.07 6.34,5.07 6.83,5.56 9.72,5.56 9.92,5.36 10.52,5.36 11.04,5.88 11.04,8.21 10.46,8.78 U10.10
  vias: v1(6.11,5.07)
SPI_CS: length 6
  Inner2 w0.09: 10.56,14.72 10.56,14.34 9.48,13.27 9.48,11.81 9.57,11.71
  Bottom Layer w0.09: U10.7 10.43,10.61 9.57,11.47 9.57,11.71
  vias: v1(9.57,11.71) v1(10.56,14.72)
SPI_CS_FLASH: length 6.1
  Top Layer w0.09: 12.81,20.92 13.2,21.31 13.2,22.23 13.64,22.67 13.64,25.89 13.46,26.08 13.25,26.08 13.05,26.28 U14.D4
SPI_CS_SD: length 9
  Top Layer w0.09: v1(8.59,5.88) 9.4,6.69 9.4,9.56 11.22,11.38 11.22,12.27 11.19,12.3
  Inner1 w0.09: v1(8.59,5.88) 8.59,5.57 v1(9.42,4.74)
  vias: v1(9.63,9.8)
SPI_MISO: length 16.1
  Top Layer w0.09: U14.F4 13.13,25.73 v1(13.3,25.73)
  Inner1 w0.09: v1(13.3,25.73) 13.3,25.73 13.3,24.44 13.62,24.12 13.62,22.62 13.14,22.14 13.14,16.14 12.91,15.91 12.07,15.91 11.64,15.48 11.64,14.34 11.07,13.77
  Inner2 w0.09: 11.07,13.77 11.07,11.95 v1(10.9,11.77)
  vias: v1(11.07,13.77)
SPI_MISO_SD: length 13.1
  Top Layer w0.09: 10.9,9.76 10.96,9.7 11.74,9.7 v1(11.79,9.76) ; v1(12.24,12.02) 11.96,12.29 11.85,12.29
  Inner1 w0.09: 10.9,9.76 10.9,9.33 7.91,6.33 5.8,6.33 4.53,5.07 3.91,5.07
  Inner2 w0.09: 11.82,9.74 11.99,9.91 11.99,11.76 12.24,12.01
  vias: v1(3.91,5.07) v1(10.9,9.76)
SPI_MOSI: length 15.2
  Inner2 w0.09: 10.05,11.72 10.54,12.21 10.54,14.04 11.23,14.72 11.31,14.72 11.32,15.44 12.8,16.92 12.8,23.51 12.63,23.68 12.63,25.67
  vias: v1(10.05,11.72) v1(11.31,14.72) v1(12.63,25.67)
SPI_MOSI_SD: length 5.6
  Top Layer w0.09: 10.07,9.75 10.07,6.86 8.32,5.1 v1(8.32,4.88)
  vias: v1(10.07,9.75)
SW: length 1.1
  Bottom Layer w0.09: U2.A4 6.78,10.8 6.8,10.78
SWCLK: length 1
  Bottom Layer w0.09: v1(4.91,13.88) 4.89,13.86 4.89,12.9
SWDIO: length 1
  Bottom Layer w0.09: 5.69,12.9 5.76,12.97 v1(5.76,13.89)
TCK: length 20.1
  Top Layer w0.09: 3.5,27.19 3.5,29.09 3.4,29.19 2.2,29.19 v1(1.99,28.99)
  Inner1 w0.09: 1.99,28.99 1.45,28.45 1.45,27.92 1.15,27.62 1.15,26.64 0.79,26.28 0.79,24.03 1.27,23.55 4.13,23.55 4.35,23.34 v1(4.35,20.41)
  Inner2 w0.09: v1(7.12,17.4) 7.12,18.04 4.74,20.41 v1(4.35,20.41)
TDI: length 10.8
  Top Layer w0.09: 4.56,19.12 4.56,19.93 4.84,20.21 4.84,26.96 4.66,27.14 4.55,27.14
  Bottom Layer w0.09: 4.89,16.83 4.89,17.2 4.49,17.6 4.49,19.09 v1(4.52,19.12)
TDO: length 12.1
  Top Layer w0.09: 4.23,27.16 4.23,27.29 4.39,27.44 4.8,27.44 5.07,27.17 5.07,19.97 4.91,19.81 4.91,19.34
  Bottom Layer w0.09: 5.69,16.83 5.69,17.18 4.7,18.17 4.7,18.72 4.93,18.95 v1(4.93,19.39)
TMS: length 13.6
  Top Layer w0.09: 4.28,27.62 3.9,27.24 ; 3.89,27.24 3.89,27.16 ; 4.29,27.62 5,27.62 5.33,27.29 5.33,19.2 v1(5.32,19.12)
  Bottom Layer w0.09: 5.31,19.09 5.31,18.97 4.93,18.58 4.93,18.22 5.22,17.92 6.1,17.92 6.49,17.53 6.49,16.83
TS: length 9.8
  Top Layer w0.09: v1(0.68,8.09) 1.16,8.57 2.75,8.57 3.46,9.28 4.65,9.28 4.91,9.54 4.91,10.41
  Inner1 w0.09: v1(0.68,8.09) 0.95,7.82 0.95,5.35 0.7,5.1
  Bottom Layer w0.09: R13.1 0.81,5.21 v1(0.7,5.11)
  vias: v1(4.91,10.4)
USB_D+: length 1
  Top Layer w0.09: R23.2 11.73,22.82 MDBT531.46
USB_D-: length 1
  Top Layer w0.09: R26.2 10.98,22.79 MDBT531.48
USB_DM: length 19.9
  Top Layer w0.09: v1(9.01,8.62) 9.01,8.34 8.14,7.47 v1(8.09,7.47)
  Inner1 w0.09: v1(10.92,23.33) 10.86,23.27 v1(10.86,20.23)
  Inner2 w0.09: 10.86,20.23 9.01,18.38 9.01,17.53 9.06,17.48 9.06,15.88 9.01,15.83 9.01,14.32 9.09,14.24 9.09,10.66 8.85,10.41 8.85,10.09 8.98,9.96 v1(8.98,9.76)
  Bottom Layer w0.09: 7.09,7.47 7.09,6.79 7.32,6.57 7.91,6.57 8.09,6.75 v1(8.09,7.47)
  Bottom Layer w0.127: v1(9.01,8.62) 9.01,9.36 9.06,9.41 8.98,9.49 v1(8.98,9.76)
USB_DP: length 19.2
  Inner1 w0.09: v1(7.61,7.6) 7.22,7.21 v1(6.59,7.21)
  Inner2 w0.09: v1(11.54,23.33) 11.54,23.18 9.39,21.04 9.39,20.07 7.56,18.24 7.56,15.49 7.48,15.41 7.48,14.88 7.56,14.8 7.56,11.48 7.7,11.34 7.7,10.54 7.56,10.4 7.56,9.69 7.94,9.31
  Bottom Layer w0.09: D2.3 7.61,8.19 v1(7.61,7.6)
  Bottom Layer w0.127: 8.06,9.41 8.06,8.69 8.05,8.68
  vias: v1(7.95,9.31)
V_BAT: length 20
  Inner2 w0.254: v1(3.22,8.39) 1.87,8.39 1.38,7.9 1.38,7.43 2.03,6.78 8.99,6.78 9.84,7.63 12.17,7.63 14.05,9.51 14.05,10.18 13.52,10.72 v1(13.42,10.72)
  Bottom Layer w0.09: R21.1 1.35,7.87 v1(1.38,7.9) 1.46,7.98 U6.C3
  Bottom Layer w0.254: C21.2 2.77,8.42 U6.C1
V_LS: length 55.5
  Top Layer w0.09: 1.32,23.9 1.71,23.5 2.94,23.5 3.47,24.03 3.55,24.03 ; 3.89,27.69 3.89,27.93 4.07,28.11 ; 4.03,28.1 4.97,28.1 5.64,27.44 ; v1(10.14,23.32) 9.37,23.32 R5.1 9.36,23.28 8.28,23.28 8.03,23.54 C7.1 ; v1(12.98,25.08) 12.98,25.47 U14.H4 ; 2.48,25.08 2.42,25.02 2.42,24.72 2.48,24.67 ; v1(7.38,30.01) 7.47,29.92 CN1.8 ; 10.19,29.54 10.14,29.59 10.14,30.1 ; 11.18,27.12 11.18,26.73 11.79,26.12 12.13,26.12 U14.D2 ; 1.25,25.97 1.63,25.97 1.84,25.76 2.12,25.76 ; 2.47,27.48 2.46,27.16
  Top Layer w0.15: 0.49,25.38 1.04,25.93 1.15,25.93 ; 1.33,27 1.33,26.13 1.14,25.95 ; 12.09,27.48 11.22,27.1 11.23,27.11
  Top Layer w0.254: U3.A1 7.61,23.64 C7.1 7.77,23.9 v1(7.77,25.01)
  Inner1 w0.09: 2.45,24.65 2.81,25 2.81,25.4 ; 11.83,24.13 11.95,24.02 11.95,22.12 11.51,21.68 11.51,20.34 10.91,19.74 10.91,14.43 10.62,14.14 10.62,12.53 10.36,12.27 10.11,12.27 ; 3.52,26.81 3.52,26.94 3.85,27.27 v1(3.85,27.64)
  Inner1 w0.254: v2(4.25,30.12) 4.67,29.71 4.67,28.39 5.65,27.41
  Bottom Layer w0.09: 1.09,25.95 1.07,25.95 0.71,25.59 0.71,24.48 0.89,24.29 1.08,24.29 1.34,24.04 ; U13.5 5.66,30.57 C38.2 ; v1(7.77,25.01) 7.77,26.29 8.26,26.78 U1.8 9.14,26.78 C11.2 ; v1(10.11,12.27) 11,12.27 11.49,11.78 U10.5 ; 2.48,24.67 2.54,24.67 2.76,24.45 v1(3.34,24.45) ; C34.1 1.98,25.98 2.12,26.12 2.59,26.12 2.8,26.32 2.8,26.94 2.47,27.26 2.47,27.48 ; 9.02,10.68 9.03,10.69 U10.15 U10.16 ; 6.79,27.05 6.79,27.09 5.97,27.09 v1(5.66,27.4) 5.62,27.45 5.4,27.45 ; 2.82,25.41 4.22,25.41
  Bottom Layer w0.127: U13.5 6.81,30.57 v1(7.38,30.01) ; v1(10.11,12.27) 9.52,12.27 9.03,11.78 U10.16
  Bottom Layer w0.254: v1(10.11,12.27) 9.69,12.69 J1.13 ; 5.4,27.45 5.4,27.48
  vias: v1(1.13,25.95) v1(2.11,26.12) v1(2.41,24.7) v1(2.47,27.48) v1(2.81,25.42) v1(3.51,26.82) v1(4.21,25.42) v1(10.15,29.54) v1(11.23,27.11) v1(11.83,24.13) v1(12.09,27.48)
V_PMID: length 6.6
  Top Layer w0.127: v1(5.76,10.41) 5.76,10.45 5.06,11.14 4.36,11.14 3.81,10.6 2.94,10.6 v1(2.72,10.38)
  Inner2 w0.127: v1(7.11,9.31) 6.02,10.41 v1(5.76,10.41)
  Bottom Layer w0.09: v1(7.11,9.31) 7.2,9.4 7.36,9.4
  Bottom Layer w0.2: U2.B4 U2.B3 5.31,10.41 v1(5.76,10.41)
V_SD: length 24.4
  Top Layer w0.09: 9.23,10.28 9.27,10.24 v1(9.27,10.2) ; 9.23,10.32 9.23,11.93 C26.1 ; 13.08,10.32 13.08,10.43
  Top Layer w0.127: 11.03,12.79 11.34,12.79 11.37,12.82 ; 11.4,12.79 11.82,12.79 11.82,12.79
  Top Layer w0.254: 13.01,10.49 13.65,9.9 13.65,9.8
  Inner1 w0.09: 12.88,10.61 13.65,9.84 v1(13.65,9.73) ; 12.88,10.61 12.87,10.62 9.68,10.62 v1(9.27,10.2) ; 12.88,10.61 11.39,12.1 11.39,12.8 11.41,12.82
  Inner1 w0.254: 13.41,3.8 13.5,3.8 13.82,4.12 13.82,9.55 v1(13.65,9.73)
  Bottom Layer w0.254: C6.1 12.71,3.81 C8.2 ; 7.55,4.96 7.55,4.75 8.28,4.02 12.5,4.02
  vias: v1(7.55,4.96) v1(11.4,12.79) v1(13.41,3.8)
VUSB: length 33.7
  Top Layer w0.09: v1(4.94,7.51) 0.86,7.51 0.56,7.22 0.56,6.89
  Top Layer w0.254: 8.55,9.46 8.55,9.53 8.29,9.8 7.02,9.8 6.58,9.35 6.14,8.91 6.14,8.15 5.5,7.51 v1(4.94,7.51)
  Inner2 w0.254: 8.55,9.46 8.55,9.7 8.35,9.91 8.35,15.75 8.24,15.85 8.24,17.53 8.35,17.64 8.35,18.58 10.13,20.36 10.13,21.1 12.4,23.37 12.4,23.4
  Bottom Layer w0.254: 6.58,9.35 5.93,10 U2.A2 ; v1(4.94,7.51) 4.94,6.8 5.46,6.29 9.41,6.29 9.74,6.61 9.74,7.47
  vias: v1(0.56,6.89) v1(6.58,9.35) v1(8.55,9.46) v1(12.4,23.4)
XL1: length 2
  Bottom Layer w0.09: 13.45,17.31 13.45,17.82 13.81,18.18 ; 13.45,17.33 13.45,16.48 C14.2
  vias: v1(13.81,18.2)
XL2: length 1.9
  Bottom Layer w0.09: v1(13.81,18.95) 13.45,19.31 13.45,20.65 C2.2
XTALI: length 1.5
  Bottom Layer w0.09: 4.21,26.8 4.25,28.31
  vias: v1(4.21,26.82)
XTALO: length 3.9
  Top Layer w0.09: 3.46,30 3.52,30.03 3.85,30.37
  Bottom Layer w0.09: 3.47,30 3.52,29.91 3.51,27.28 3.85,27.02 3.86,26.83
  vias: v1(3.86,26.82) v2(3.46,29.98)
$1N36: length 1.3
  Bottom Layer w0.09: v1(2.81,5.07) 2.77,5.11 R19.1
$1N48: length 1.7
  Inner1 w0.09: R7.2 8.64,7.47 v1(8.59,7.47)
  vias: v1(9.75,8.65)
$1N49: length 3.8
  Bottom Layer w0.09: R8.2 3.23,9.22 3.23,8.9 3.31,8.81 3.43,8.81 3.53,8.72 3.53,8.59 3.7,8.41 5.41,8.41 5.59,8.23 5.59,7.47
$1N65: length 2.2
  Top Layer w0.09: 4.95,10.86 5.24,10.56 5.24,8.83 v1(5.25,8.82)
  vias: v1(4.91,10.8)
$1N70: length 1.2
  Bottom Layer w0.09: U6.B3 0.68,10 C23.2
$1N74: length 2
  Top Layer w0.09: v1(0.68,9.21) 0.99,8.9 2.14,8.9 2.46,9.22
  vias: v1(2.46,9.22)
$1N98: length 1.8
  Top Layer w0.09: 13.27,22.88 12.52,22.88 12.49,22.85 MDBT531.44
$1N117: length 1
  Top Layer w0.09: 5.51,12.26 5.78,12.26 6.26,12.74 6.36,12.74
$1N119: length 1.8
  Top Layer w0.09: 6.35,12.27 6.35,12.24 5.98,11.87 5.24,11.87 4.89,12.22
$1N151: length 1.9
  Top Layer w0.09: 2.73,28.69 2.71,28.67 2.71,27.84 2.81,27.73 2.81,27.16 ; 2.81,26.81 2.81,27.16
$1N2586: length 1.8
  Top Layer w0.09: 3.16,25.06 3.16,24.89 3.28,24.78 3.85,24.78 4.39,24.24 C32.1
$1N16368: length 1.1
  Bottom Layer w0.09: 2.56,29.62 3.33,30.39 3.33,30.43
  vias: v1(3.34,30.45)

## Copper pours and planes (outline as drawn; the poured copper is in the pictures)
+1.8V on Inner2: 3.85,23.47 3.85,17.12 4.86,17.12 4.86,15.73 3.85,15.73 3.85,12.17 0.16,12.17 -0.03,1.87 0.06,1.17 0.43,0.55 0.96,0.16 1.63,-0.01 12.8,0.01 13.42,0.15 14,0.45 14.36,0.95 14.6,1.54 14.58,23.43
+1.8V on POWER PLANE: 3.85,23.47 3.85,17.12 4.86,17.12 4.86,15.73 3.85,15.73 3.85,12.17 0,12.19 0.01,1.75 0.12,1.12 0.44,0.54 1.01,0.17 1.69,0 12.95,0.03 13.54,0.18 14.06,0.49 14.41,1.02 14.58,1.67 14.59,23.42
GND on GROUND PLANE: 0.3,27.18 0.12,25.95 0.12,23.47 3.8,23.47 3.8,17.12 4.82,17.12 4.82,15.72 3.8,15.72 3.8,12.17 0.11,12.17 0.09,1.89 0.12,1.24 0.53,0.58 1.01,0.24 1.64,0.02 12.91,0.08 13.43,0.18 13.99,0.55 14.29,0.96 14.54,1.69 14.56,23.83 14.48,26.75 14.02,28.2 12.82,30.14 11.76,31.15 9.81,32.2 4.72,32.2 3.46,31.63 1.89,30.33 0.88,28.88
GND on Inner1: 9.73,32.23 4.73,32.2 2.67,31.03 1.12,29.3 0.2,27.23 0.03,25.33 0.12,23.47 3.8,23.47 3.8,17.12 4.82,17.12 4.82,15.72 3.8,15.72 3.8,12.17 0.12,12.17 -0.02,1.78 0.13,1.12 0.47,0.56 0.94,0.22 1.51,0.02 13.06,0.02 13.59,0.17 14.07,0.54 14.39,1.02 14.59,1.62 14.6,25.77 14.09,27.97 13.08,29.8 11.64,31.2
V_LS on Inner2: 14.62,23.67 -0.02,23.77 0.1,26.68 0.94,29.01 2.53,30.97 4.77,32.17 9.75,32.16 12,30.94 13.61,28.94 14.44,26.85
V_LS on POWER PLANE: 14.56,23.68 0,23.78 0.11,26.74 0.96,28.98 4.77,32.22 9.76,32.21 12.05,30.93 13.57,29.02 14.5,26.71

## Text on the board
Bottom Silkscreen Layer: B | OUT | LR | IN | S- | S+ | B+ | B-
Top Silkscreen Layer: v2.0
